# EAGLE design CAN Transceiver 4.0 rev1 (EAGLE 9.6.2)
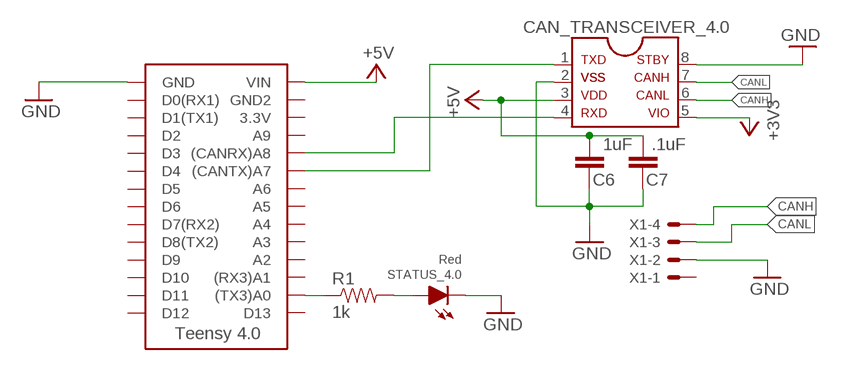
[diagram p0: schematic, sheet 1]

## Parts
C6  1uF  CAP0603-CAP  [0603-CAP]
C7  .1uF  CAP0603-CAP  [0603-CAP]
CAN_TRANSCEIVER_4.0  MCP2562SOIC-08  [SOIC-08]
R1  1k  RESISTOR0603-RES  [0603-RES]
STATUS_4.0  Red  LED-0805  [LED-805]
U$2  TEENSY_4.0_SIMPLE  [TEENSY_4.0_SIMPLE]
X1  CONNECTOR-4NANO-FIT_RIGHT_ANGLE-4-SURFACE  [NANO-FIT_RIGHT_ANGLE-4-SURFACE]

## Nets
+5V: C6.2 C7.2 CAN_TRANSCEIVER_4.0.3 U$2.VIN
CANH: CAN_TRANSCEIVER_4.0.6 X1.4
CANL: CAN_TRANSCEIVER_4.0.7 X1.3
GND: C6.1 C7.1 CAN_TRANSCEIVER_4.0.2 STATUS_4.0.C U$2.GND X1.2
N$1: R1.2 STATUS_4.0.A
N$2: R1.1 U$2.(TX3)A0
N$3: CAN_TRANSCEIVER_4.0.4 U$2.(CANRX)A8
N$4: CAN_TRANSCEIVER_4.0.1 U$2.(CANTX)A7
N$5: CAN_TRANSCEIVER_4.0.8 ; supply symbol labelled GND
N$6: CAN_TRANSCEIVER_4.0.5 ; supply symbol labelled +3V3
Unconnected: U$2.3.3V U$2.(RX3)A1 U$2.A2 U$2.A3 U$2.A4 U$2.A5 U$2.A6 U$2.A9 U$2.D0(RX1) U$2.D1(TX1) U$2.D2 U$2.D3 U$2.D4 U$2.D5 U$2.D6 U$2.D7(RX2) U$2.D8(TX2) U$2.D9 U$2.D10 U$2.D11 U$2.D12 U$2.D13 U$2.GND2 X1.1

## Library data of the parts
C6 C7 = HyTechDevices:CAP: Capacitor Standard 0603 ceramic capacitor, and 0.1" leaded capacitor.
CAN_TRANSCEIVER_4.0 = HyTechDevices:MCP2562: MCP2562 High-speed CAN Transceiver Datatsheet <http://ww1.microchip.com/downloads/en/devicedoc/20005167c.pdf>
R1 = HyTechDevices:RESISTOR: Resistor Basic schematic elements and footprints for 0603, 1206, and PTH resistors.
STATUS_4.0 = HyTechDevices:LED: Light Emitting Diode (LED) Source: Dangerous Prototypes Eagle Library <https://github.com/DangerousPrototypes/Eagle_Part_Library>
U$2 = HyTechDevices:TEENSY_4.0_SIMPLE: Simple version of the Teensy 4.0 board that only uses the 2 main rows of pins, with no perpendicular row with VBat.
X1 = HyTechDevices:CONNECTOR-4: Mini-Fit Junior connector 4 pole Source: http://www.molex.com

## Board
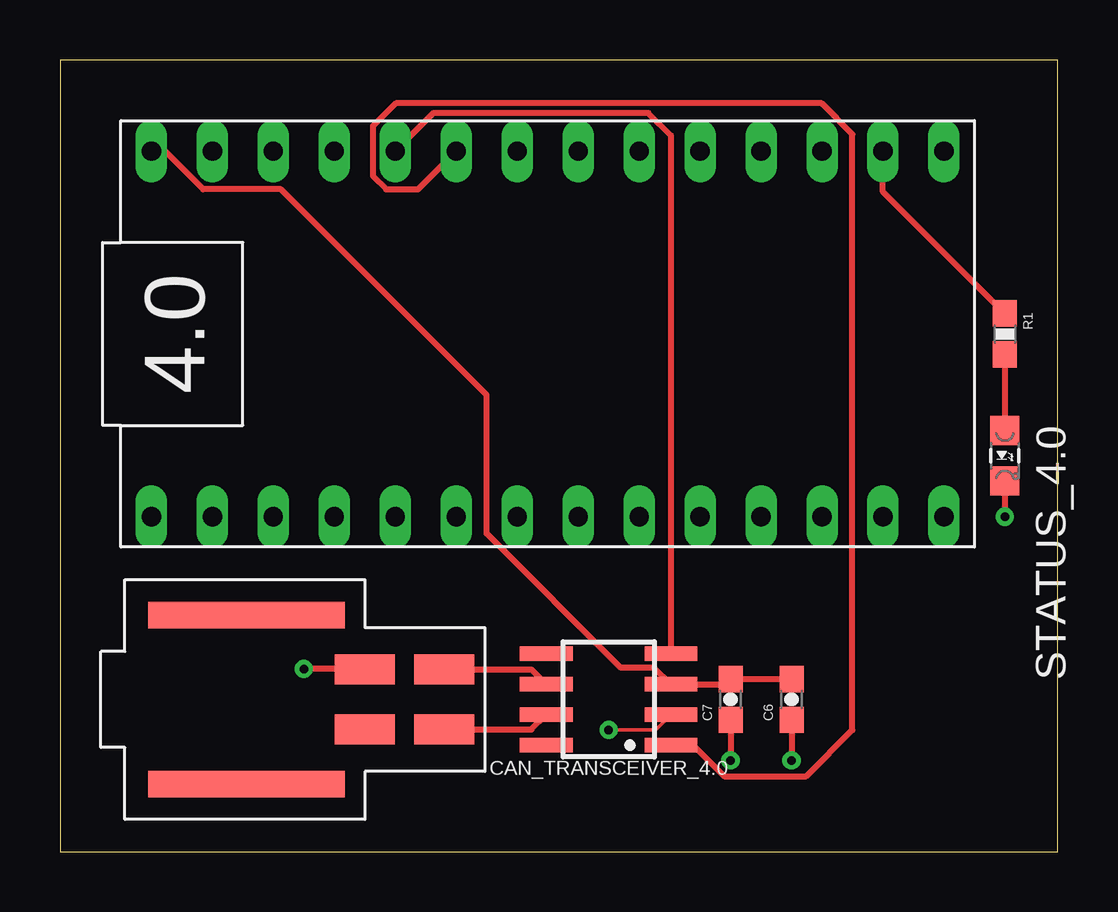
[diagram p1: board, top side]
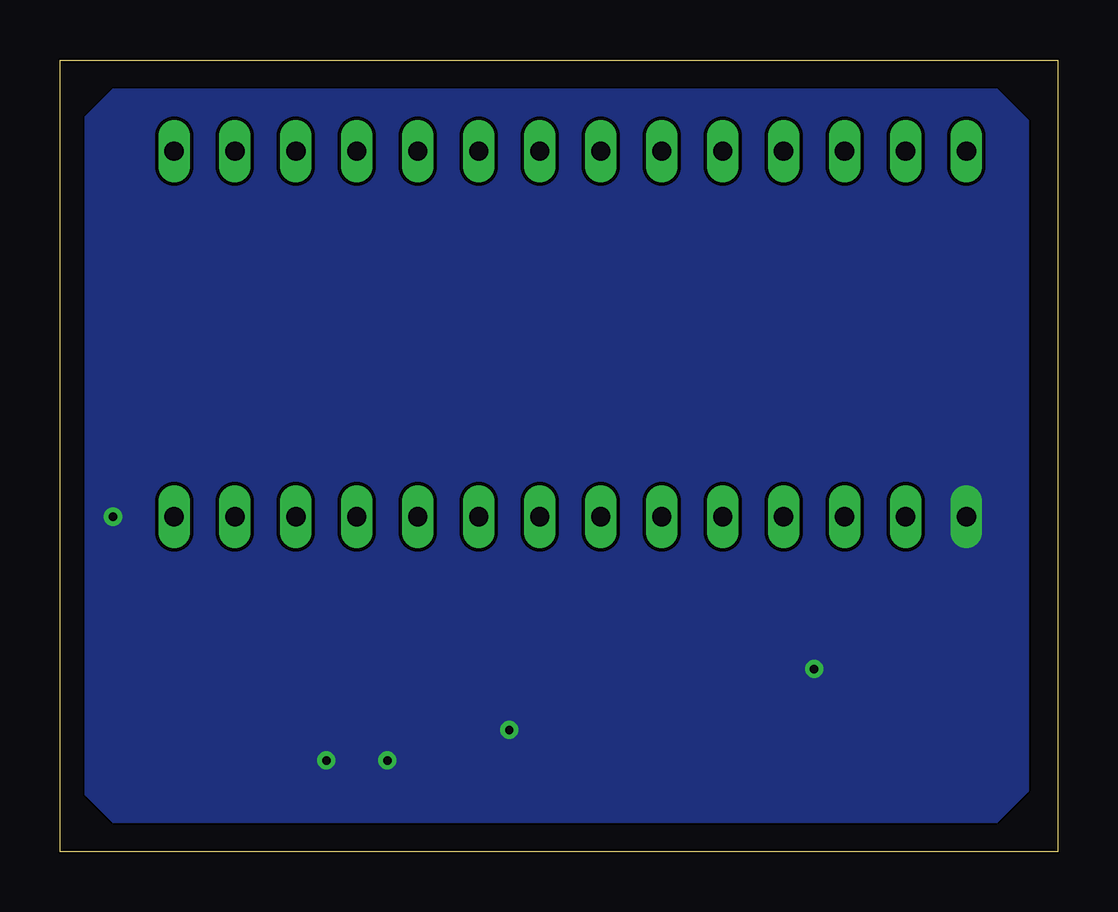
[diagram p2: board, bottom side, seen from below]

Size 41.58 x 33.01 mm. Coordinates in mm from the lower left corner, seen from the top.
Outline: 0,0 41.58,0 41.58,33.01 0,33.01 0,0
Copper layers (1*16): Top 0.035mm / dielectric 1.5mm / Bottom 0.035mm
Design rules "default": minimum track width 6mil, minimum drill 0.35mm, track to track 6mil, track to pad 6mil, pad to pad 6mil, via to via 6mil, smd to smd 6mil, copper to edge 40mil, drill to drill 6mil, minimum pad ring 10mil, minimum via ring 8mil, stop-mask expansion 4mil, vias tented up to drill 0mil, thermal gap 10mil

### Footprints (pad centres in the part's own frame; a part is rotated, then mirrored left to right if it is on the bottom)
0603-CAP = smd 1.1 x 1: 1 -0.85,0; 2 0.85,0
SOIC-08 = smd 0.6 x 2.2: 1 -1.905,-2.6; 2 -0.635,-2.6; 3 0.635,-2.6; 4 1.905,-2.6; 5 1.905,2.6; 6 0.635,2.6; 7 -0.635,2.6; 8 -1.905,2.6
0603-RES = smd 1.1 x 1: 1 -0.85,0; 2 0.85,0
LED-805 = smd 1.2 x 1.2: A 0,-1.05; C 0,1.05
TEENSY_4.0_SIMPLE = drill 0.8 long: 3.3V 16.51,29.21; (CANRX)A8 16.51,24.13; (CANTX)A7 16.51,21.59; (RX3)A1 16.51,6.35; (TX3)A0 16.51,3.81; A2 16.51,8.89; A3 16.51,11.43; A4 16.51,13.97; A5 16.51,16.51; A6 16.51,19.05; A9 16.51,26.67; D0(RX1) 1.27,31.75; D1(TX1) 1.27,29.21; D2 1.27,26.67; D3 1.27,24.13; D4 1.27,21.59; D5 1.27,19.05; D6 1.27,16.51; D7(RX2) 1.27,13.97; D8(TX2) 1.27,11.43; D9 1.27,8.89; D10 1.27,6.35; D11 1.27,3.81; D12 1.27,1.27; D13 16.51,1.27; GND 1.27,34.29; GND2 16.51,31.75; VIN 16.51,34.29
NANO-FIT_RIGHT_ANGLE-4-SURFACE = smd 1.24 x 2.5: 1 1.25,0; 2 -1.25,0; 3 1.25,3.3; 4 -1.25,3.3 | smd 1.1 x 8.2: P$5 -3.52,-4.93; P$6 3.52,-4.93

### Placement (x,y rotation side)
C6  30.48,6.35 90 top
C7  27.94,6.35 90 top
CAN_TRANSCEIVER_4.0  22.86,6.35 90 top
R1  39.37,21.59 270 top
STATUS_4.0  39.37,16.51 180 top
U$2  38.1,12.7 90 top
X1  12.7,6.35 270 top

### Tracks (layer width: path | path; a pad name or v marks a point on that pad's centre or on a via)
+5V
  Top 0.254: C6.2 C7.2 27.73,6.99 CAN_TRANSCEIVER_4.0.3 24.77,7.68 23.37,7.68 17.78,13.27 17.78,19.05 9.21,27.62 5.96,27.62 4.38,29.21 U$2.VIN
CANH
  Top 0.254: X1.4 19.64,7.6 CAN_TRANSCEIVER_4.0.6
CANL
  Top 0.254: X1.3 19.64,5.1 CAN_TRANSCEIVER_4.0.7
GND  (via drill 0.35)
  Top 0.152: CAN_TRANSCEIVER_4.0.2 24.82,5.08 v22.86,5.08
  Top 0.254: STATUS_4.0.C v39.37,13.97 | C7.1 v27.94,3.81 | C6.1 v30.48,3.81 | X1.2 12.68,7.62 v10.16,7.62
  pour Bottom (no thermals): 2.54,31.75 39.37,31.75 40.64,30.48 40.64,2.54 39.37,1.27 2.54,1.27 1.27,2.54 1.27,30.48
N$1
  Top 0.254: R1.2 STATUS_4.0.A
N$2
  Top 0.254: R1.1 34.29,27.52 U$2.(TX3)A0
N$3
  Top 0.254: CAN_TRANSCEIVER_4.0.4 25.46,29.85 24.52,30.8 15.56,30.8 U$2.(CANRX)A8
N$4
  Top 0.254: CAN_TRANSCEIVER_4.0.1 26.38,4.45 27.67,3.15 31.09,3.15 33.02,5.08 33.02,29.91 31.73,31.2 13.99,31.2 13.04,30.25 13.04,28.17 13.58,27.62 14.92,27.62 U$2.(CANTX)A7